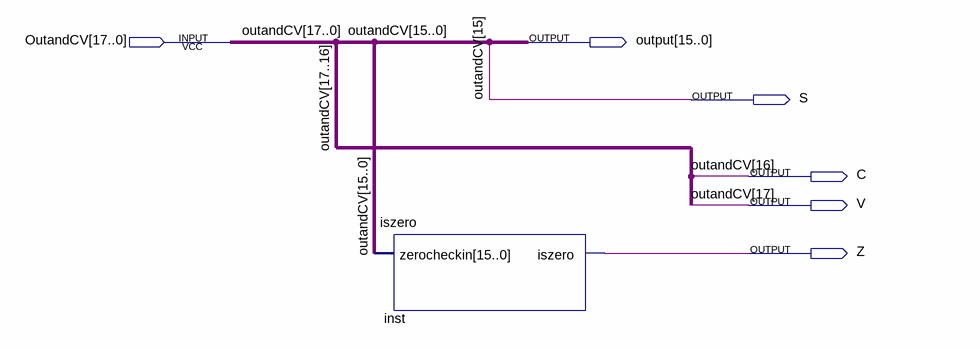
[diagram p0: schematic sheet]
// Quartus schematic makeoutput.bdf as structural Verilog: 1 symbols, 6 pins
module makeoutput (
  input  [17:0] OutandCV,
  output [15:0] \output ,
  output S,
  output C,
  output V,
  output Z
);

  iszero inst (.zerocheckin(OutandCV[15:0]), .iszero(Z));

  assign C = OutandCV[16];
  assign \output  = OutandCV[15:0];
  assign S = OutandCV[15];
  assign V = OutandCV[17];
endmodule
